# EAGLE schematic SimpleMixer (EAGLE 6.5.0)
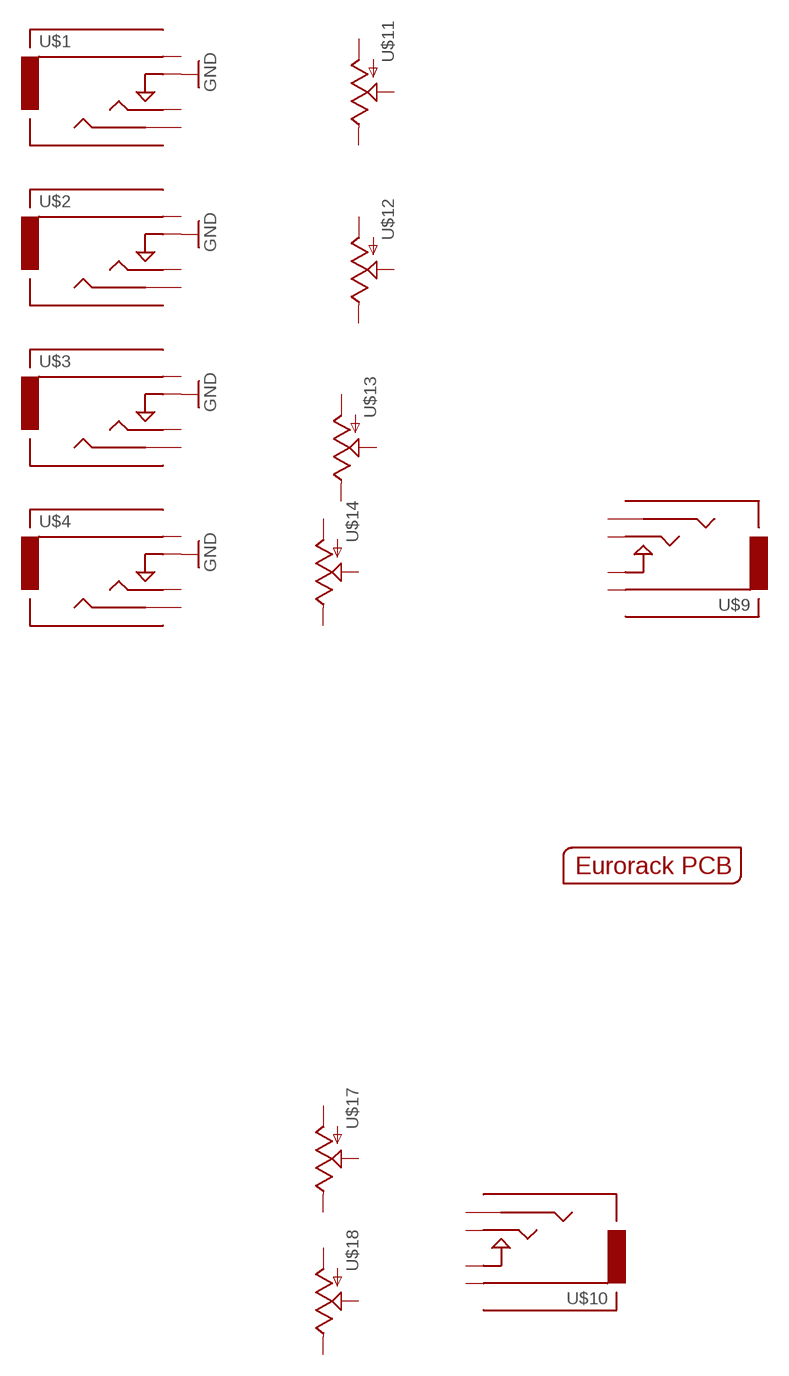
[diagram p0: schematic, sheet 1]

## Parts
U$1  AUDIO-JACKINPUT  [3.5MM-JACK-SWITCH-13MM-INPUT]
U$2  AUDIO-JACKINPUT  [3.5MM-JACK-SWITCH-13MM-INPUT]
U$3  AUDIO-JACKINPUT  [3.5MM-JACK-SWITCH-13MM-INPUT]
U$4  AUDIO-JACKINPUT  [3.5MM-JACK-SWITCH-13MM-INPUT]
U$9  AUDIO-JACKOUTPUT  [3.5MM-JACK-SWITCH-13MM-OUTPUT]
U$10  AUDIO-JACKOUTPUT  [3.5MM-JACK-SWITCH-13MM-OUTPUT]
U$11  POTZEPHPOT  [OG-POTS_ALPS_POT_VERTICAL]
U$12  POTZEPHPOT  [OG-POTS_ALPS_POT_VERTICAL]
U$13  POTZEPHPOT  [OG-POTS_ALPS_POT_VERTICAL]
U$14  POTZEPHPOT  [OG-POTS_ALPS_POT_VERTICAL]
U$17  POTZEPHPOT  [OG-POTS_ALPS_POT_VERTICAL]
U$18  POTZEPHPOT  [OG-POTS_ALPS_POT_VERTICAL]
U$19  EURORACK_PCB8HP  [EURORACK8HPPCB]

## Nets
GND: U$1.SWITCH@1(SWITCH) U$1.SWITCH@2(SWITCH) U$2.SWITCH@1(SWITCH) U$2.SWITCH@2(SWITCH) U$3.SWITCH@1(SWITCH) U$3.SWITCH@2(SWITCH) U$4.SWITCH@1(SWITCH) U$4.SWITCH@2(SWITCH)
Unconnected: U$1.RING@1(RING) U$1.RING@2(RING) U$1.SECOND@1(SECOND) U$1.SECOND@2(SECOND) U$1.TIP@1(TIP) U$1.TIP@2(TIP) U$2.RING@1(RING) U$2.RING@2(RING) U$2.SECOND@1(SECOND) U$2.SECOND@2(SECOND) U$2.TIP@1(TIP) U$2.TIP@2(TIP) U$3.RING@1(RING) U$3.RING@2(RING) U$3.SECOND@1(SECOND) U$3.SECOND@2(SECOND) U$3.TIP@1(TIP) U$3.TIP@2(TIP) U$4.RING@1(RING) U$4.RING@2(RING) U$4.SECOND@1(SECOND) U$4.SECOND@2(SECOND) U$4.TIP@1(TIP) U$4.TIP@2(TIP) U$9.RING@1(RING) U$9.RING@2(RING) U$9.SECOND@1(SECOND) U$9.SECOND@2(SECOND) U$9.SWITCH@1(SWITCH) U$9.SWITCH@2(SWITCH) U$9.TIP@1(TIP) U$9.TIP@2(TIP) U$10.RING@1(RING) U$10.RING@2(RING) U$10.SECOND@1(SECOND) U$10.SECOND@2(SECOND) U$10.SWITCH@1(SWITCH) U$10.SWITCH@2(SWITCH) U$10.TIP@1(TIP) U$10.TIP@2(TIP) U$11.P$1(E) U$11.P$2(S) U$11.P$3(A) U$12.P$1(E) U$12.P$2(S) U$12.P$3(A) U$13.P$1(E) U$13.P$2(S) U$13.P$3(A) U$14.P$1(E) U$14.P$2(S) U$14.P$3(A) U$17.P$1(E) U$17.P$2(S) U$17.P$3(A) U$18.P$1(E) U$18.P$2(S) U$18.P$3(A)

## Library data of the parts
U$1-U$4 U$9 U$10 = EurorackModularParts:AUDIO-JACK: Switching Mono 3.5mm Audio Jack from Erthenvar.
U$11-U$14 U$17 U$18 = EurorackModularParts:POT
U$19 = EurorackModularParts:EURORACK_PCB